# EAGLE design XPNET hub (EAGLE 9.4.2)
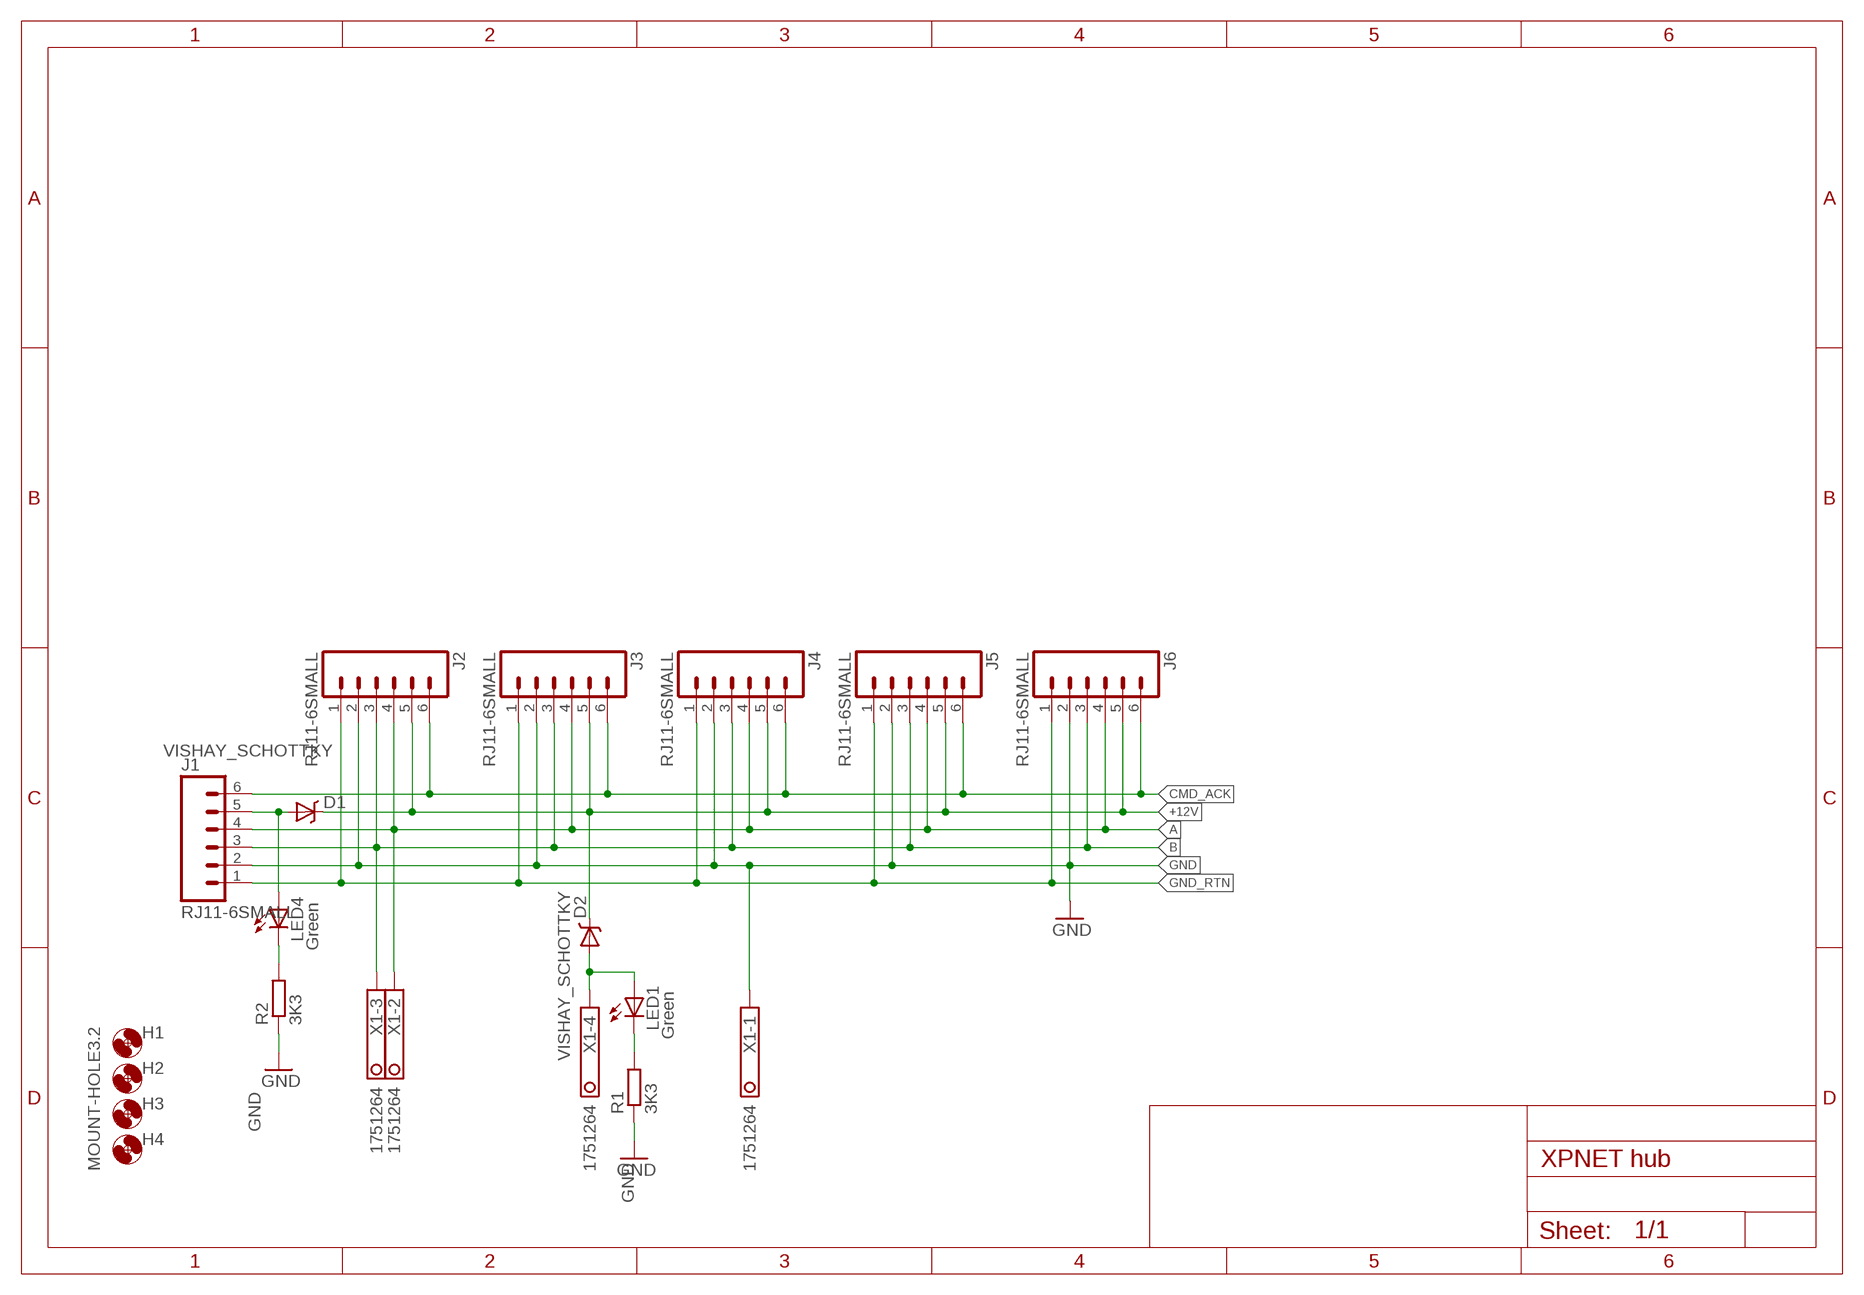
[diagram p0: schematic, sheet 1]

## Parts
D1  VISHAY_SCHOTTKY  [DO-220AA]
D2  VISHAY_SCHOTTKY  [DO-220AA]
H1  MOUNT-HOLE3.2  [3,2]
H2  MOUNT-HOLE3.2  [3,2]
H3  MOUNT-HOLE3.2  [3,2]
H4  MOUNT-HOLE3.2  [3,2]
J1  RJ11-6SMALL  [RJ11-6-2]
J2  RJ11-6SMALL  [RJ11-6-2]
J3  RJ11-6SMALL  [RJ11-6-2]
J4  RJ11-6SMALL  [RJ11-6-2]
J5  RJ11-6SMALL  [RJ11-6-2]
J6  RJ11-6SMALL  [RJ11-6-2]
LED1  Green  LED3MM  [LED3MM]
LED4  Green  LED3MM  [LED3MM]
R1  3K3  R-EU_R0805  [R0805]
R2  3K3  R-EU_R0805  [R0805]
X1  1751264  [1751264]

## Nets
+12V: D1.CATHODE(C) D2.CATHODE(C) J2.5 J3.5 J4.5 J5.5 J6.5
+21V1: D2.ANODE(A) LED1.A X1.4
A: J1.4 J2.4 J3.4 J4.4 J5.4 J6.4 X1.2
B: J1.3 J2.3 J3.3 J4.3 J5.3 J6.3 X1.3
CMD_ACK: J1.6 J2.6 J3.6 J4.6 J5.6 J6.6
GND: J1.2 J2.2 J3.2 J4.2 J5.2 J6.2 R1.1 R2.1 X1.1
GND_RTN: J1.1 J2.1 J3.1 J4.1 J5.1 J6.1
N$1: D1.ANODE(A) J1.5 LED4.A
N$3: LED1.K(C) R1.2
N$19: LED4.K(C) R2.2

## Library data of the parts
D1 D2 = Ava:VISHAY_SCHOTTKY: VISHAY - SS2P3-M3/84A - DIODE, RECTIFIER, SCHOTTKY, 2A, 30V, SMP Farnell 1812484
H1-H4 = holes:MOUNT-HOLE: MOUNTING HOLE with drill center marker
J1-J6 = GJR:RJ11-6: RJ11 Jack Simple 6 pin RJ11 jack. Commonly found on CAT3 devices and Microchip programmers. SKU: PRT-00132
LED1 LED4 = adafruit:LED: LED OSRAM: - CHIPLED LG R971, LG N971, LY N971, LG Q971, LY Q971, LO R971, LY R971 LH N974, LH R974 LS Q976, LO Q976, LY Q976 LO Q996 - Hyper CHIPLED LW Q18S LB Q993, LB Q99A, LB R99A - SideLED LS A670, LO A670, LY A670, LG A670, LP A670 LB A673, LV A673, LT A673, LW A673 LH A674 LY A675 LS A676, LA A676, LO A676, LY A676, LW A676 LS A679, LY A679, LG A679 - Hyper Micro SIDELED® LS Y876, LA Y876, LO Y876, LY Y876 LT Y87S - SmartLED LW L88C, LW L88S LB L89C, LB L89S, LG L890 LS L89K, LO L89K, LY L89K LS L896, LA L896, LO L896, LY L896 - TOPLED LS T670, LO T670, LY T670, LG T670, LP T670 LSG T670, LSP T670, LSY T670, LOP T670, LYG T670 LG T671, LOG T671, LSG T671 LB T673, LV T673, LT T673, LW T673 LH T674 LS T676, LA T676, LO T676, LY T676, LB T676, LH T676, LSB T676, LW T676 LB T67C, LV T67C, LT T67C, LS T67K, LO T67K, LY T67K, LW E67C LS E67B, LA E67B, LO E67B, LY E67B, LB E67C, LV E67C, LT E67C LW T67C LS T679, LY T679, LG T679 LS T770, LO T770, LY T770, LG T770, LP T770 LB T773, LV T773, LT T773, LW T773 LH T774 LS E675, LA E675, LY E675, LS T675 LS T776, LA T776, LO T776, LY T776, LB T776 LHGB T686 LT T68C, LB T68C - Hyper Mini TOPLED® LB M676 - Mini TOPLED Santana® LG M470 LS M47K, LO M47K, LY M47K Source: http://www.osram.convergy.de/
R1 R2 = rcl:R-EU_: RESISTOR, European symbol
X1 = con-phoenix-350:1751264: MKDS 1/ 4-3,5 Printklemme Nennstrom: 10 A Bemessungsspannung: 160 V Raster: 3,5 mm Polzahl: 4 Montageart: Löten Anschlussart: Schraubanschluss Anschlussrichtung vom Leiter zur Platine: 0° Source: http://eshop.phoenixcontact.com .. 1751264.pdf; MPN: 1751264; OC_FARNELL: unknown; OC_NEWARK: 10R0934

## Board
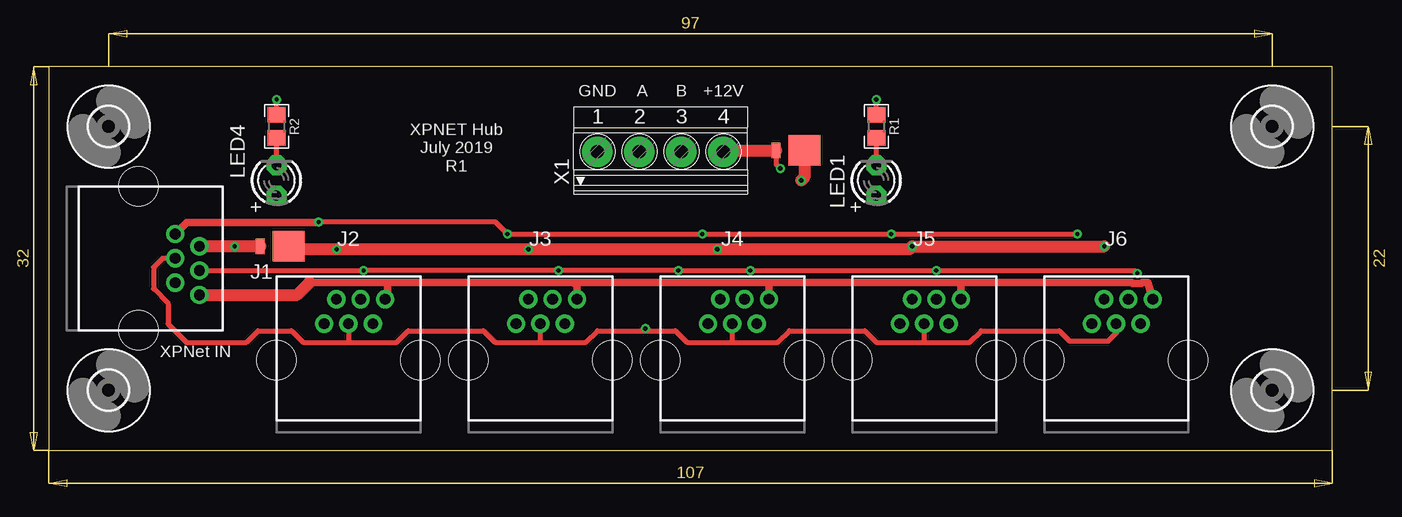
[diagram p1: board, top side]
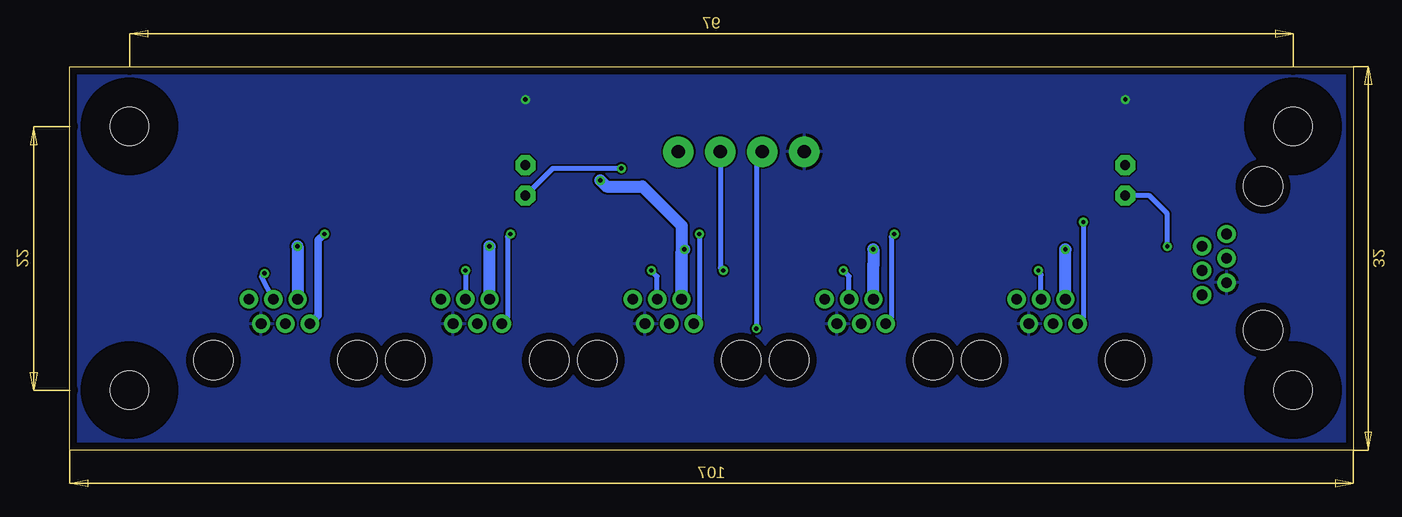
[diagram p2: board, bottom side, seen from below]

Size 107 x 32 mm. Coordinates in mm from the lower left corner, seen from the top.
Outline: 0,0 107,0 107,32 0,32 0,0
Copper layers (1*16): Top 0.035mm / dielectric 1.5mm / Bottom 0.035mm
Design rules "default": minimum track width 6mil, minimum drill 0.35mm, track to track 6mil, track to pad 6mil, pad to pad 6mil, via to via 6mil, smd to smd 6mil, copper to edge 25mil, drill to drill 6mil, minimum pad ring 10mil, minimum via ring 8mil, stop-mask expansion 4mil, vias tented up to drill 0mil, thermal gap 10mil

### Footprints (pad centres in the part's own frame; a part is rotated, then mirrored left to right if it is on the bottom)
DO-220AA = smd 0.762 x 1.27: ANODE 2.351,0 | smd 2.67 x 2.54: CATHODE 0,0
3,2 = hole 3.2: 0,0
RJ11-6-2 = drill 0.889 pad 1.524: 1 3.048,5.08; 2 2.032,3.048; 3 1.016,5.08; 4 0,3.048; 5 -1.016,5.08; 6 -2.032,3.048 | hole 3.251: -6,0; 6,0
LED3MM = drill 0.813 pad 1.676 octagon: A -1.27,0; K 1.27,0
R0805 = smd 1.3 x 1.5: 1 -0.95,0; 2 0.95,0
1751264 = drill 1.1 pad 2.54: 1 -5.25,-0.1; 2 -1.75,-0.1; 3 1.75,-0.1; 4 5.25,-0.1

### Placement (x,y rotation side)
D1  20,17 180 top
D2  63,25 180 top
H1  5,5 0 top
H2  5,27 0 top
H3  102,5 0 top
H4  102,27 0 top
J1  7.5,16 270 top
J2  25,7.5 0 top
J3  41,7.5 0 top
J4  57,7.5 0 top
J5  73,7.5 0 top
J6  89,7.5 0 top
LED1  69,22.5 90 top
LED4  19,22.5 90 top
R1  69,27 270 top
R2  19,27 270 top
X1  51,25 0 top

### Tracks (layer width: path | path; a pad name or v marks a point on that pad's centre or on a via)
+12V  (via drill 0.35)
  Top 1.016: D1.CATHODE 20.25,16.75 v24,16.75 v40,16.75 v55.75,16.75 71.75,16.75 v72,17 v88,17 | D2.CATHODE 63,22.75 v62.75,22.5
  Bottom 1.016: v88,17 88,12.58 J6.5 | v72,17 71.98,16.98 J5.5 | v55.75,16.75 55.79,16.75 55.89,16.64 55.98,16.58 J4.5 55.98,18.73 59.25,22 62.25,22 v62.75,22.5 | J3.5 39.98,15.48 40,15.5 v40,16.75 | v24,16.75 23.98,16.73 J2.5
+21V1  (via drill 0.35)
  Top 0.406: D2.ANODE 60.65,23.85 v61,23.5
  Top 1.016: X1.4 56.35,25 D2.ANODE
  Bottom 0.406: v61,23.5 66.73,23.5 LED1.A
A  (via drill 0.35)
  Top 0.406: J1.4 9.5,16 8.75,15.25 8.75,13.47 9.96,12.26 9.96,10.54 11.5,9 16.5,9 17.47,9.96 20.26,9.96 21.22,9 25,9 | J2.4 25,9 | 41,9 37.22,9 36.26,9.96 29.98,9.96 29.02,9 25,9 | 41,9 J3.4 | 41,9 44.78,9 45.74,9.96 49.75,9.96 | 49.75,9.96 52.26,9.96 53.22,9 57,9 | 57,9 J4.4 | 57,9 60.78,9 61.74,9.96 68.04,9.96 69,9 73,9 | 73,9 J5.4 | 73,9 76.78,9 77.74,9.96 84.26,9.96 85.11,9.11 88.36,9.11 89.02,9.77 89,9.77 J6.4 | v49.75,10.14 49.75,9.96
  Bottom 0.406: X1.2 49.75,24.4 v49.75,10.14
B  (via drill 0.35)
  Top 0.406: J1.3 v26.25,14.98 v42.5,14.98 v52.5,14.98 v58.5,14.98 v74,14.98 90.52,14.98 v90.75,14.75
  Bottom 0.406: v90.75,14.75 91.02,14.48 J6.3 | J5.3 74,12.6 v74,14.98 | J4.3 58.02,14.5 v58.5,14.98 | v42.5,14.98 42.02,14.5 J3.3 | v26.25,14.98 26.25,14.88 26.02,14.65 J2.3 | X1.3 52.75,15.23 v52.5,14.98
CMD_ACK  (via drill 0.35)
  Top 0.406: 22.5,19 v22.5,19.04 37.25,19.04 v38.25,18.04 v54.5,18.04 v70.25,18.04 v85.75,18.04
  Top 0.61: J1.6 11.52,19 22.5,19
  Bottom 0.406: v70.25,18.04 70.5,17.79 70.5,11.02 J5.6 | J4.6 54.78,10.55 54.72,10.53 54.5,10.75 v54.5,18.04 | v38.25,18.04 38.5,17.79 38.5,11.02 J3.6 | J2.6 22.5,11.02 v22.5,19.04
  Bottom 0.61: v85.75,18.04 86.27,17.52 86.27,11.25 J6.6
GND  (via drill 0.35)
  Top 0.406: R1.1 v69,29.25 | R2.1 v19,29.25
  pour Bottom: 0,32 107,32 107,0 0,0
GND_RTN
  Top 0.61: J6.1 91.63,14 91.18,14 91.1,13.91 90.4,13.91 90.32,14 76.05,14 | 21.75,14 28.25,14 | 28.25,14 43.75,14 | J2.1 28.25,12.58 28.25,14 | J3.1 44.05,13.7 43.75,14 | J4.1 60.05,14 | J5.1 76.05,14 | 43.75,14 60.05,14 | 60.05,14 76.05,14
  Top 1.016: J1.1 20.7,12.95 21.75,14
N$1  (via drill 0.35)
  Top 1.016: D1.ANODE v15.5,17 12.6,17 J1.5
  Bottom 0.406: v15.5,17 15.5,19.75 16.98,21.23 LED4.A
N$3
  Top 0.406: LED1.K R1.2
N$19
  Top 0.406: LED4.K R2.2

### Text on the board
tPlace: GND | A | B | +12V | XPNET Hub / July 2019 / R1 | XPNet IN